# Altium schematic sheet current_conditioning.SchDoc
size A4; DocumentNumber: 2; SheetNumber: 2; SheetTotal: 4
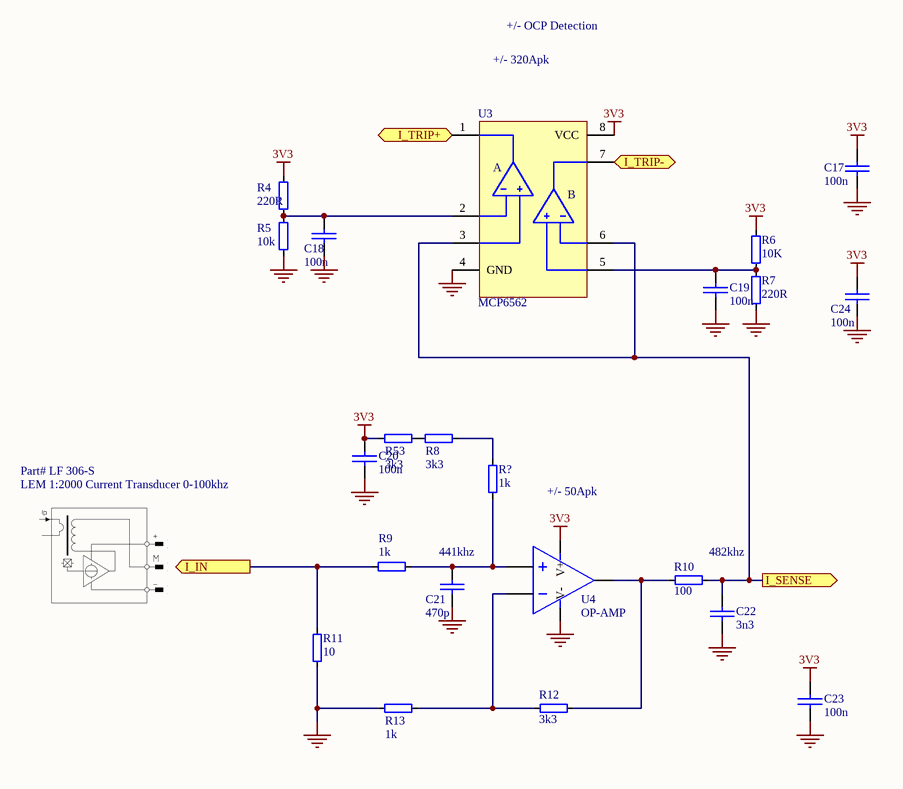
[diagram p0: current_conditioning.SchDoc]

## Parts
C17  100n  [0603]
C18  100n  [0603]
C19  100n  [0603]
C20  100n  [0603]
C21  470p  [0603]
C22  3n3  [0603]
C23  100n  [0603]
C24  100n  [0603]
R4  220R  [0603]
R5  10k  [0603]
R6  10K  [0603]
R7  220R  [0603]
R8  3k3  [0603]
R9  1k  [0603]
R10  100  [0603]
R11  10  [1206]
R12  3k3  [0603]
R13  1k  [0603]
R53  3k3  [0603]
R?  1k  [0603]
U3  MCP6562  [MSOP8]
U4  OP-AMP  [SOT23-5]

## Ports
I_IN (out), I_SENSE (out), I_TRIP+ (out), I_TRIP- (out)

## Nets
3V3: C17.1 C20.2 C23.1 C24.1 R4.2 R6.2 R53.1 U3.8(VCC) U4.5(V+)
GND: C17.2 C18.2 C19.2 C20.1 C21.2 C22.1 C23.2 C24.2 R5.1 R7.1 R11.1 R13.1 U3.4(GND) U4.2(V-)
I_IN: R9.1 R11.2 ; port I_IN
I_SENSE: C22.2 R10.2 U3.3(+A) U3.6(-B) ; port I_SENSE
I_TRIP+: U3.1(OUTA) ; port I_TRIP+
I_TRIP-: U3.7(OUTB) ; port I_TRIP-
NetC18_1: C18.1 R4.1 R5.2 U3.2(-A)
NetC19_1: C19.1 R6.1 R7.2 U3.5(+B)
NetC21_1: C21.1 R9.2 R?.1 U4.3(IN+)
NetR8_1: R8.1 R53.2
NetR8_2: R8.2 R?.2
NetR10_1: R10.1 R12.2 U4.1(OUT)
NetR12_1: R12.1 R13.2 U4.4(IN-)

## Notes on the sheet
- +/- OCP Detection
- +/- 320Apk
- LEM 1:2000 Current Transducer 0-100khz
- Part# LF 306-S
- +/- 50Apk
- 441khz
- (near R10) 482khz
- (in symbol COMPARATOR DUAL draft) A; B

## Library data of the parts
C17 C20 C22 C23 = CAP
C18 C19 C21 C24 = CAP: Capacitor; Status: Draft
R4-R13 R53 R? = RES4: Parameter: 1%, Thick or Metal Film, 63mW
U3 = COMPARATOR DUAL draft: Manufacturer 1: Microchip MCP6562
U4 = OP-AMP: Operational Amplifier; Manufacturer 1: Microchip MCP6283T; Parameter: >1MHz, 3.3V, rail-rail.; Digikey Part Number: MCP6283T-E/CHCT-ND; Manufacturer 2: Fairchild FAN4174IS5X; Status: Draft